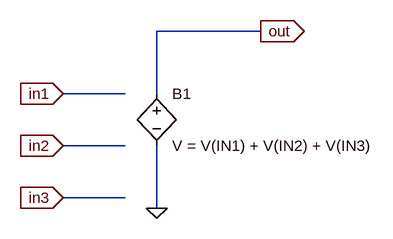
[diagram p0: schematic adder3.asc]
adder3.asc, the LTspice schematic file:
Version 4
SHEET 1 880 680
WIRE 640 32 480 32
WIRE 432 128 336 128
WIRE 480 128 480 32
WIRE 432 208 336 208
WIRE 432 288 336 288
WIRE 480 304 480 208
FLAG 336 208 in2
IOPIN 336 208 In
FLAG 336 128 in1
IOPIN 336 128 In
FLAG 480 304 0
FLAG 640 32 out
IOPIN 640 32 Out
FLAG 336 288 in3
IOPIN 336 288 In
SYMBOL bv 480 112 R0
SYMATTR InstName B1
SYMATTR Value V = V(IN1) + V(IN2) + V(IN3)

The netlist it stands for:
* adder3.asc
B1 out 0 V = V(IN1) + V(IN2) + V(IN3)
.backanno
.end